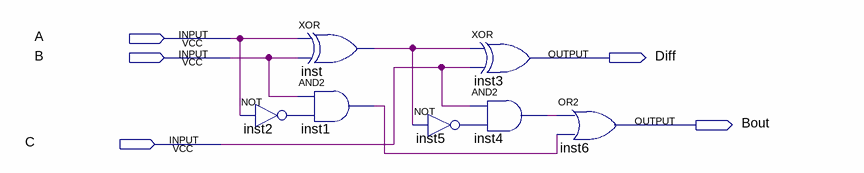
[diagram p0: schematic sheet]
// Quartus schematic Full-Subtractor.bdf as structural Verilog: 7 symbols, 5 pins
module \Full-Subtractor  (
  input  A,
  input  B,
  input  C,
  output Diff,
  output Bout
);

  wire inst1_out, inst2_out, inst4_out, inst5_out, inst_out;

  not inst2 (inst2_out, A);
  xor inst (inst_out, A, B);
  and inst1 (inst1_out, B, inst2_out);
  not inst5 (inst5_out, inst_out);
  xor inst3 (Diff, inst_out, C);
  and inst4 (inst4_out, C, inst5_out);
  or inst6 (Bout, inst4_out, inst1_out);
endmodule
